# Altium schematic sheet 02_Power_Supply.SchDoc
size A4; SheetNumber: 2; SheetTotal: 9
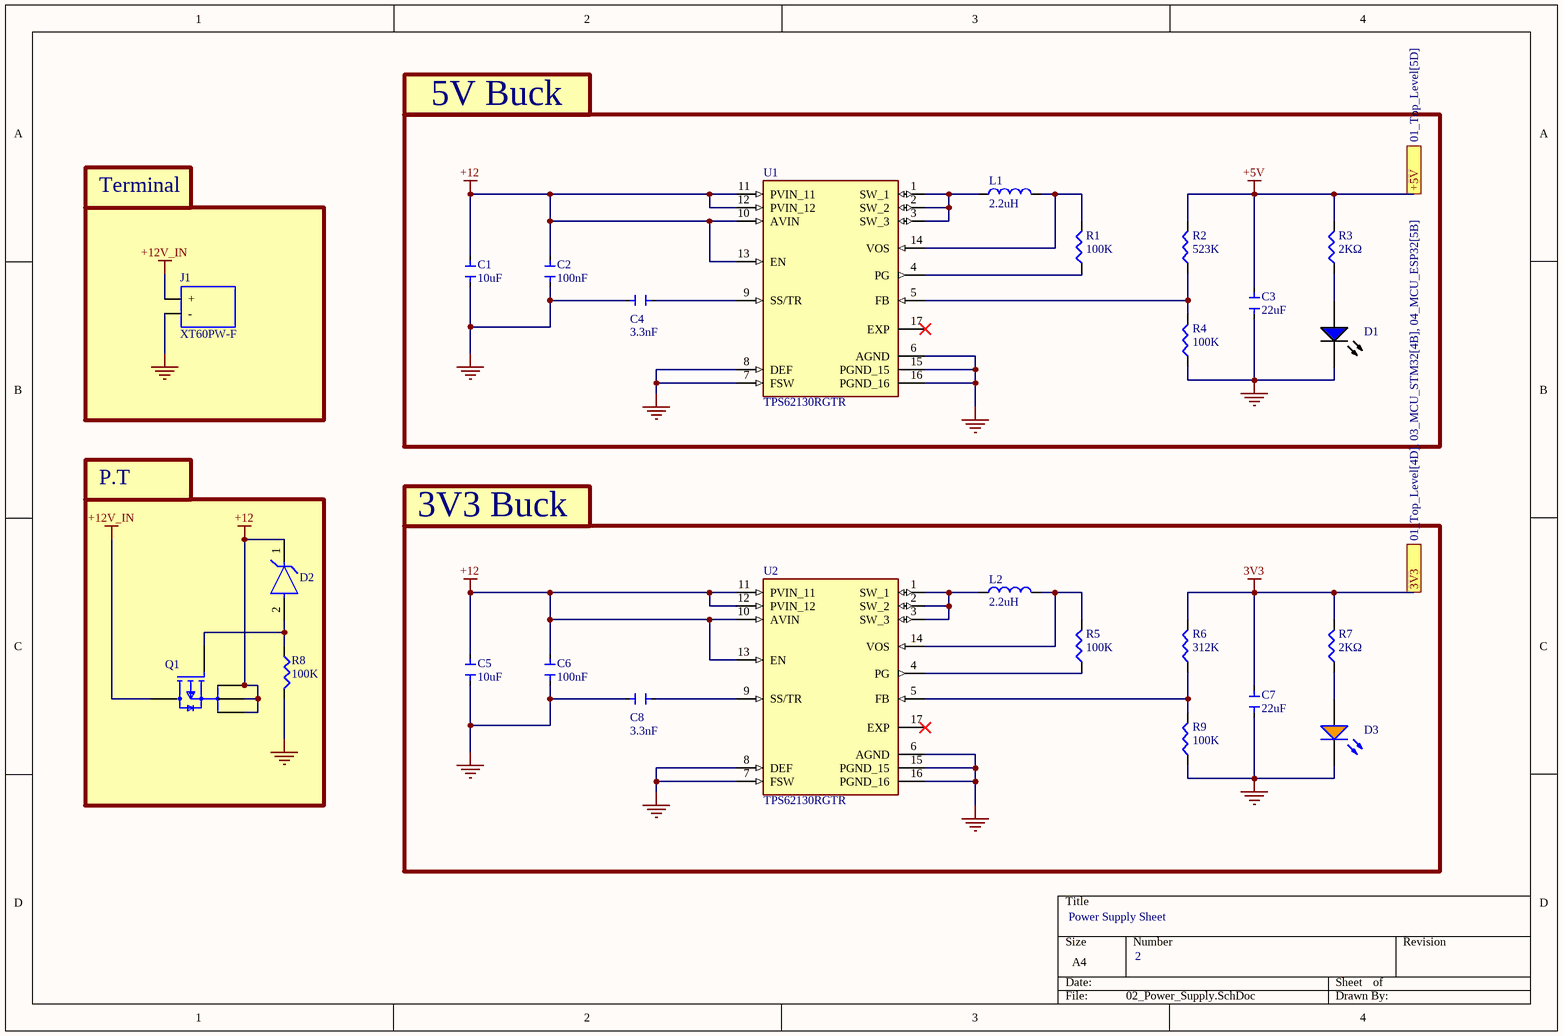
[diagram p0: 02_Power_Supply.SchDoc]

## Parts
C1  10uF  [CAP_10uF]
C2  100nF  [CAP_100nF]
C3  22uF  [CAP_22uF]
C4  3.3nF  [CAP_0603_0.33uF]
C5  10uF  [CAP_10uF]
C6  100nF  [CAP_100nF]
C7  22uF  [CAP_22uF]
C8  3.3nF  [CAP_0603_0.33uF]
D1  HSMR-C190  [AVAG-HSMX-C190_V]  (value not drawn)
D2  SMAZ15-13-F  [FP-SMA-MFG]  (value not drawn)
D3  HSMD-C190  [AVAG-HSMX-C190_V]  (value not drawn)
J1  XT60PW-F  [XT60PW-F]
L1  2.2uH  [IND_2.2uH]
L2  2.2uH  [IND_2.2uH]
Q1  SQJ431AEP-T1_GE3  [FP-S19-0643-SINGLE-MFG]  (value not drawn)
R1  100K  [RES_100K]
R2  523K  [RES_523K]
R3  2KΩ  [RES_312K]
R4  100K  [RES_100K]
R5  100K  [RES_100K]
R6  312K  [RES_523K]
R7  2KΩ  [RES_312K]
R8  100K  [RES_100K]
R9  100K  [RES_100K]
U1  TPS62130RGTR  [QFN50P300X300X100-17N]
U2  TPS62130RGTR  [QFN50P300X300X100-17N]

## Blocks framed on the sheet
5V Buck: C1-C4 D1 L1 R1-R4 U1
Terminal: J1
P.T: D2 Q1 R8
3V3 Buck: C5-C8 D3 L2 R5-R7 R9 U2

## Ports
3V3 (see 01_Top_Level[4D], 03_MCU_STM32[4B], 04_MCU_ESP32[5B]), +5V (see 01_Top_Level[5D])

## Nets
3V3: C7.2 R6.2 R7.2 ; port 3V3
+5V: C3.2 R2.2 R3.2 ; port +5V
+12: C1.2 C2.2 C5.2 C6.2 D2.1(C) Q1.1(S) Q1.2(S) Q1.3(S) U1.10(AVIN) U1.11(PVIN_11) U1.12(PVIN_12) U1.13(EN) U2.10(AVIN) U2.11(PVIN_11) U2.12(PVIN_12) U2.13(EN)
+12V_IN: J1.1(+) Q1.5-6-7-8(D)
GND: C1.1 C2.1 C3.1 C4.2 C5.1 C6.1 C7.1 C8.2 D1.2(K) D3.2(K) J1.2(-) R4.1 R8.2 R9.1 U1.6(AGND) U1.7(FSW) U1.8(DEF) U1.15(PGND_15) U1.16(PGND_16) U2.6(AGND) U2.7(FSW) U2.8(DEF) U2.15(PGND_15) U2.16(PGND_16)
NetC4_1: C4.1 U1.9(SS/TR)
NetC8_1: C8.1 U2.9(SS/TR)
NetD1_1: D1.1(A) R3.1
NetD2_2: D2.2(A) Q1.4(G) R8.1
NetD3_1: D3.1(A) R7.1
NetL1_1: L1.1 U1.1(SW_1) U1.2(SW_2) U1.3(SW_3)
NetL1_2: L1.2 R1.2 U1.14(VOS)
NetL2_1: L2.1 U2.1(SW_1) U2.2(SW_2) U2.3(SW_3)
NetL2_2: L2.2 R5.2 U2.14(VOS)
NetR1_1: R1.1 U1.4(PG)
NetR2_1: R2.1 R4.2 U1.5(FB)
NetR5_1: R5.1 U2.4(PG)
NetR6_1: R6.1 R9.2 U2.5(FB)

Not connected (* = marked no-connect by the designer): U1 17(EXP)*; U2 17(EXP)*

## Notes on the sheet
- Power Supply Sheet
- 2

## Library data of the parts
C1 C5 = CAP_0402_10UF: CAP CER 10UF 10V X5R 0402; Manufacturer: Samsung Electro-Mechanics; Manufacturer Part Number: C307415; Dielectric Material: Ceramic; Multilayer: Yes; Tolerance  (fill in as +-): 20%; Supplier: LCSC; Supplier Part Number: 1276-6830-1-ND; RoHS: Yes; Category: Ceramic Capacitors; Stock: 1294909; Pricing: 1=0.33, 10=0.215, 50=0.1584, 100=0.129, 500=0.1018, 1000=0.08597, 2500=0.08145 (USD); Mounting Technology: Surface Mount; Pins: 2; Package Shape: Rectangular; Case/Package: 0402; Terminal Finish: Nickel; Min Operating Temperature: -55°C; Max Operating Temperature: 85°C; JESD-609 Code: e3; Value: 10uF; Capacitor Type: Ceramic; Packaging: Tape and Reel; Tolerance (fill in as +-): 20%; Rated DC Voltage (URdc): 10V; Temperature Characteristics Code: X5R; Termination: Wraparound; Reach SVHC Compliant: Yes; RoHS Compliant: Yes; ComponentLink1URL: https://datasheet.ciiva.com:443/pdfs/VipMasterIC/IC/SEMS/SEMS-S-A0008521219/SEMS-S-A0008521325-1.pdf?src-supplier=IHS+Markit; ComponentLink1Description: https://datasheet.ciiva.com:443/pdfs/VipMasterIC/IC/SEMS/SEMS-S-A0008521219/SEMS-S-A0008521325-1.pdf?src-supplier=IHS+Markit; ComponentLink2URL: http://www.samsungsem.com/kr/support/product-search/mlcc/CL05A106MP8NUB8.jsp?src-supplier=Digikey; ComponentLink2Description: http://www.samsungsem.com/kr/support/product-search/mlcc/CL05A106MP8NUB8.jsp?src-supplier=Digikey; ComponentLink3URL: https://datasheet.octopart.com/CL05A106MP8NUB8-Samsung-Electro-Mechanics-datasheet-136460857.pdf?src-supplier=Future+Electronics; ComponentLink3Description: https://datasheet.octopart.com/CL05A106MP8NUB8-Samsung-Electro-Mechanics-datasheet-136460857.pdf?src-supplier=Future+Electronics; LCSC Part Number: C307415
C2 C6 = CAP_100nF: CAP 100nF 50V X7R ±10% 0603 Ceramic Capacitors RoHS; manufacturer: YAGEO; manufacturer part number: CC0603KRX7R9BB104; value: 100nf; supplier: LCSC; supplier part number: C14663; ComponentLink1Description: Datasheet; ComponentLink1URL: https://www.lcsc.com/datasheet/C14663.pdf
C3 C7 = CAP_22uF: CAP 22uF 25V X5R ±20% 0805 Ceramic Capacitors RoHS; manufacturer: Samsung Electro-Mechanics; manufacturer part number: CL21A226MAYNNNE; ComponentLink1Description: Datasheet; ComponentLink1URL: https://www.lcsc.com/datasheet/C602037.pdf; Value: 22uF; supplier: LCSC; supplier part number: C602037
C4 C8 = CAP_0603_0.33uF
D1 = CMP-007-00015-2: LED Uni-Color Blue, 78 mW, 20 mA, -40 to 85 degC, 2-Pin SMD, RoHS, Tape and Reel; Manufacturer: Avago; Forward Voltage: 3.4V; Power: 78mW; Forward Current: 20mA; Luminous Intensity: 55mcd; Lens Style: Diffused; Viewing Angle: 155degrees; Pins: 2; Max Operating Temperature: 85°C; Colour: Blue; Datasheet Version: Apr-10; RoHS Compliant: True; Mounting Technology: SM; Min Operating Temperature: -40°C; Illumination Colour: Blue; Package Quantity: 4000; Datasheet URL: http://docs.avagotech.com/docs/AV02-0977EN; Package Reference: HSMX-C190; Packaging: TapeandReel; Nominal Vf: 3.4V; Case/Package: 0603; Package Description: 2-Pin Surface Mount Device, Body 1.6 x 0.8 mm, Height 0.9 mm; Manufacturer URL: http://www.avagotech.com/
D2 = CMP-12792-000022-1: DIODE ZENER 15V 1W SMA; Manufacturer: Diodes; Forward Current: 200mA; Max Reverse Leakage Current: 1uA; Max Junction Temp: +150°C; Standoff Height: 0.05mm; Reverse Voltage: 11.4V; Zener Impedance: 10Ω; Max Zener Voltage: 15.75V; ComponentLink2URL: https://www.diodes.com/assets/Datasheets/ds18015.pdf; ComponentLink2Description: Datasheet; Nom Zener Voltage: 15V; Category: Diode; Device Class L2: Diodes; Lead Free: Yes; Power Dissipation: 1W; Automotive: No; Octopart: https://octopart.com/smaz15-13-f-diodes+inc.-334038; Temperature Range Low: -65°C; Temperature Range High: +150°C; Package: SMA; Temperature: -65°C to +150°C; Digikey Description: DIODE ZENER 15V 1W SMA; Manufacturer Part Number: SMAZ15-13-F; Mouser Description: Zener Diodes 15V 1W; Footprint Url: https://www.diodes.com/assets/Package-Files/SMA.pdf; Device Class L3: Zener Diodes; RoHS: TRUE; Device Class L1: Discrete Semiconductors; Height: 2.4mm
D3 = CMP-007-00012-2: LED Uni-Color Orange, 52 mW, 20 mA, -40 to 85 degC, 2-Pin SMD, RoHS, Tape and Reel; Manufacturer: Avago; Lens Style: Diffused; Forward Voltage: 2.2V; Forward Current: 20mA; Viewing Angle: 170degrees; Power: 52mW; Luminous Intensity: 8mcd; Min Operating Temperature: -40°C; Packaging: TapeandReel; Colour: Orange; Nominal Vf: 2.2V; Pins: 2; Case/Package: 0603; Max Operating Temperature: 85°C; Illumination Colour: Orange; Package Description: 2-Pin Surface Mount Device, Body 1.6 x 0.8 mm, Height 0.9 mm; Manufacturer URL: http://www.avagotech.com/; Datasheet Version: Mar-12; RoHS Compliant: True; Datasheet URL: http://docs.avagotech.com/docs/AV02-0551EN; Mounting Technology: SM; Package Reference: HSMX-C190; Package Quantity: 4000
J1 = CMP-008-000007-1: Manufacturer: Changzhou Amass Elec; Component Type: Standard; Pin Count: 2; Source: connectors.SchLib; Mnaufacturer Part Number: XT60PW-F; Datasheet Link: https://www.lcsc.com/datasheet/C428722.pdf; Design Item ID: XT60PW-F
L1 L2 = IND_2.2uH: 2.2uH Magnetic Shielded Inductor 7A SMD,12.3x12.3mm Fixed Inductors RoHS
Q1 = CMP-02550-000283-1: MOSFET P-CH 200V 9.4A PPAK SO-8; RoHS Compliant: Yes
R1 R4 R5 R8 R9 = RES_0603_100K: 100KΩ ±1% 0603 Thick Film Resistor; ComponentLink1Description: datasheet; ComponentLink1URL: https://www.lcsc.com/product-detail/C23025.html?s_z=n_resistance%2520300
R2 = RES_0603_523K: RES Thick Film, 523KΩ, 1%, 0.33W, 100ppm/°C, 0603; Max Power Dissipation: 250mW; Length: 0.063inch; Min Operating Temperature: -55°C; Contact Plating: Tin; Max Operating Temperature: 155°C; Number of Terminations: 2; Case/Package: 0603; Resistance: 523K; Height: 0.022inch; Package Quantity: 5000; Radiation Hardening: No; Composition: Thick Film; Tolerance: 1%; Temperature Coefficient: 100ppm/°C; Width: 0.033inch; Packaging: Tape and Reel; Features: Automotive AEC-Q200; Lead Free: Lead Free
R3 R7 = RES_0603_312K: Fixed Resistor, Thin Film, 0.1W, 2K, 75V, 0.1% +/-Tol, 25ppm/Cel, Surface Mount, 0603; Manufacturer: Yageo Group; Manufacturer Part Number: RT0603BRD07383KL; Manufacturer: 383kΩ; Max Power Dissipation: 100mW; Temperature Coefficient: 25ppm/°C; Supplier: Mouser; Supplier Part Number: 603-RT0603BRD07383KL; RoHS: Compliant; Category: Chip SMD Resistors; Stock: 416; Pricing: 1=0.18, 10=0.076, 50=0.076, 100=0.069, 1000=0.062, 10000=0.04 (USD); Case/Package: 0603; Case Code (Imperial): 0603; Case Code (Metric): 1608; China RoHS: Non-Compliant; Composition: Thin Film; Features: Moisture Resistant; Height: 450µm; Length: 1.6002mm; Lifecycle Status: Production; Max Operating Temperature: 155°C; Min Operating Temperature: -55°C; Mounting Technology: Surface Mount; Number of Terminals: 2; Number of Terminations: 2; Packaging: Tape & Reel; Power Dissipation: 100mW; Power Rating: 100mW; REACH SVHC: Yes; Termination: SMD/SMT; Tolerance: 0.1%; Voltage Rating: 75V; Width: 800µm; Working Voltage: 75V; ComponentLink1URL: https://datasheet.octopart.com:443/RT0603BRD07383KL-Yageo-datasheet-176402239.pdf?src-supplier=Future+Electronics; ComponentLink1Description: https://datasheet.octopart.com:443/RT0603BRD07383KL-Yageo-datasheet-176402239.pdf?src-supplier=Future+Electronics; ComponentLink2URL: https://datasheet.octopart.com:443/RT0603BRD07383KL-Yageo-datasheet-169971040.pdf?src-supplier=Future+Electronics; ComponentLink2Description: https://datasheet.octopart.com:443/RT0603BRD07383KL-Yageo-datasheet-169971040.pdf?src-supplier=Future+Electronics; ComponentLink3URL: https://datasheet.octopart.com:443/RT0603BRD07383KL-Yageo-datasheet-166250672.pdf?src-supplier=Future+Electronics; ComponentLink3Description: https://datasheet.octopart.com:443/RT0603BRD07383KL-Yageo-datasheet-166250672.pdf?src-supplier=Future+Electronics; ComponentLink4URL: https://datasheet.octopart.com:443/RT0603BRD07383KL-Yageo-datasheet-137700930.pdf?src-supplier=Future+Electronics; ComponentLink4Description: https://datasheet.octopart.com:443/RT0603BRD07383KL-Yageo-datasheet-137700930.pdf?src-supplier=Future+Electronics; ComponentLink5URL: https://datasheet.octopart.com:443/RT0603BRD07383KL-Yageo-datasheet-96443642.pdf?src-supplier=Upverter; ComponentLink5Description: https://datasheet.octopart.com:443/RT0603BRD07383KL-Yageo-datasheet-96443642.pdf?src-supplier=Upverter; ComponentLink6URL: https://datasheet.octopart.com/RT0603BRD07383KL-Yageo-datasheet-86813807.pdf; ComponentLink6Description: https://datasheet.octopart.com/RT0603BRD07383KL-Yageo-datasheet-86813807.pdf; ComponentLink7URL: http://sigma.octopart.com:80/conflict_mineral_statement/Yageo-company-3.pdf?src-supplier=Compliance+Statements; ComponentLink7Description: http://sigma.octopart.com:80/conflict_mineral_statement/Yageo-company-3.pdf?src-supplier=Compliance+Statements; ComponentLink8URL: http://sigma.octopart.com:80/rohs_statement/Yageo-company-2.pdf?src-supplier=Compliance+Statements; ComponentLink8Description: http://sigma.octopart.com:80/rohs_statement/Yageo-company-2.pdf?src-supplier=Compliance+Statements; Supplier: LCSC; Supplier Part Number: C861359; Datasheet Link: https://www.lcsc.com/datasheet/C861359.pdf
R6 = RES_0603_523K: RES Thick Film, 312KΩ, 1%, 0.33W, 100ppm/°C, 0603; Max Power Dissipation: 250mW; Resistance: 523K; Length: 0.063inch; Min Operating Temperature: -55°C; Contact Plating: Tin; Max Operating Temperature: 155°C; Number of Terminations: 2; Case/Package: 0603; Height: 0.022inch; Package Quantity: 5000; Radiation Hardening: No; Composition: Thick Film; Tolerance: 1%; Temperature Coefficient: 100ppm/°C; Width: 0.033inch; Packaging: Tape and Reel; Features: Automotive AEC-Q200; Lead Free: Lead Free
U1 U2 = TPS62130RGTR: 3-17V 3A Step-Down Converter with DCS-Control in 3x3 QFN Package; MF: Texas Instruments; SnapEDA_Link: https://www.snapeda.com/parts/TPS62130RGTR/Texas+Instruments/view-part/?ref=snap; Package: VQFN-16 Texas Instruments; Value: *; MP: TPS62130RGTR; Check_prices: https://www.snapeda.com/parts/TPS62130RGTR/Texas+Instruments/view-part/?ref=eda